# EAGLE design devkit (EAGLE 9.6.2)

## Sheet 1 of 2
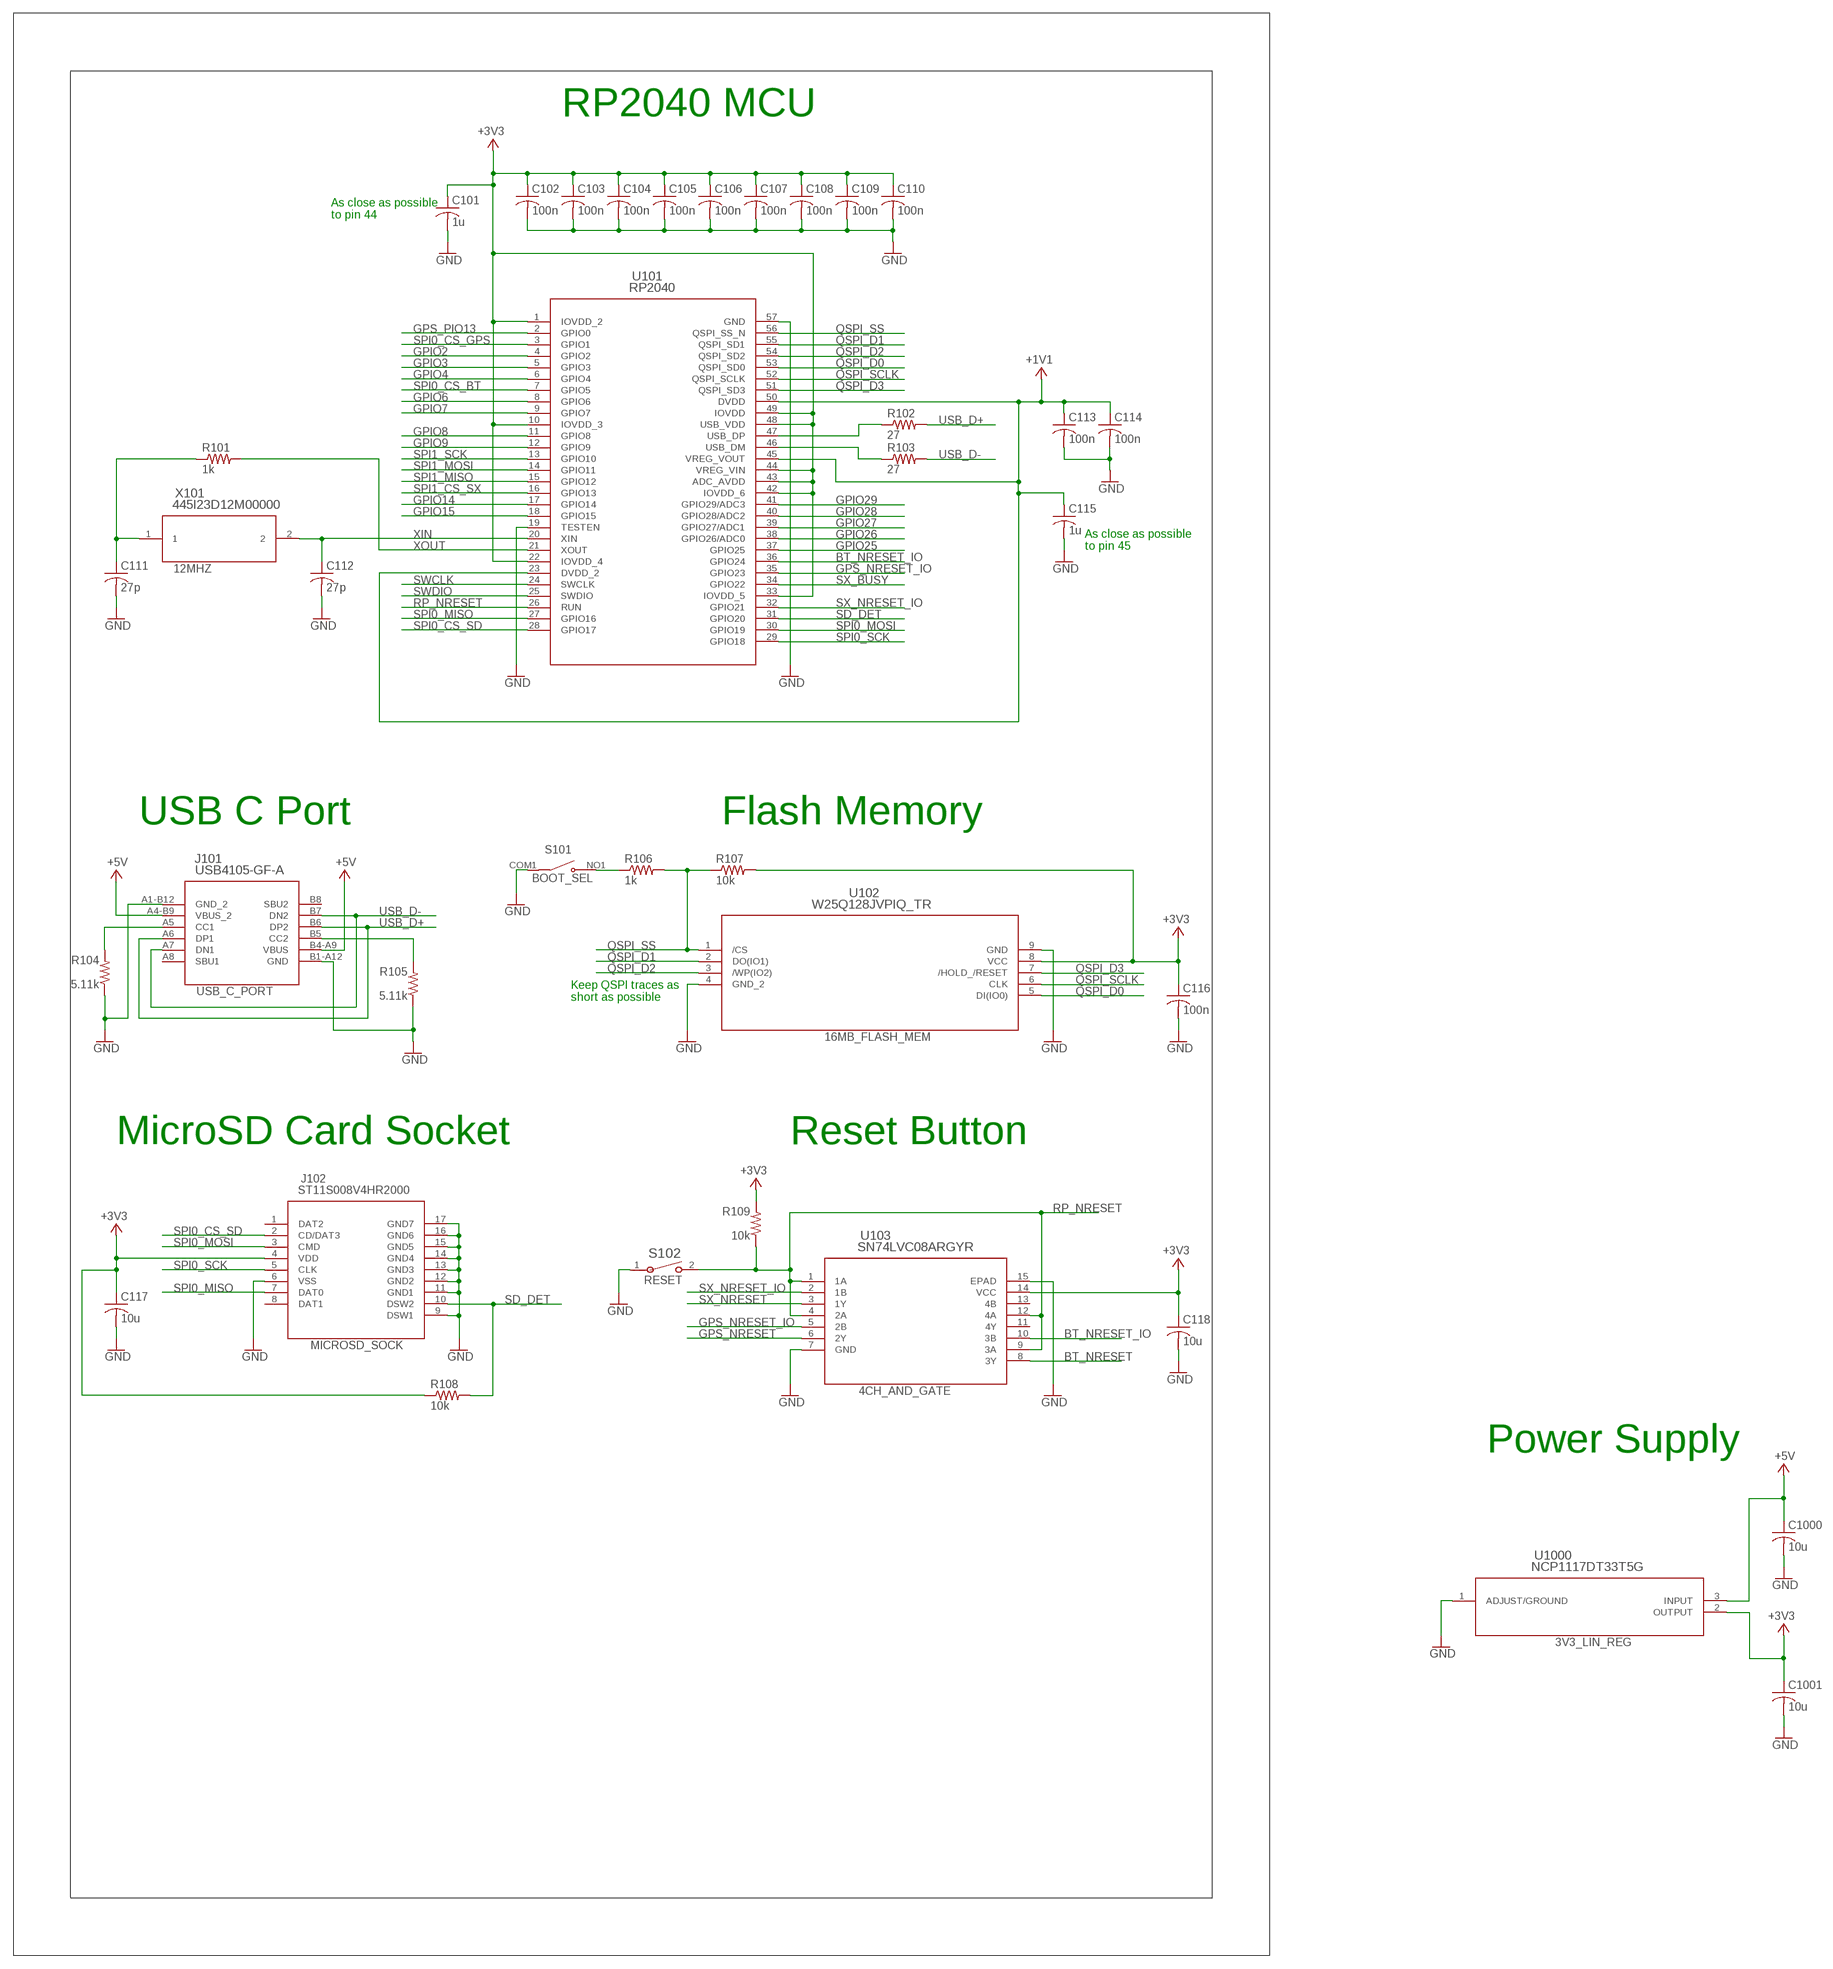
[diagram p0: schematic, sheet 1]

### Parts
C101  1u  C-USC0402  [C0402]
C102  100n  C-USC0402  [C0402]
C103  100n  C-USC0402  [C0402]
C104  100n  C-USC0402  [C0402]
C105  100n  C-USC0402  [C0402]
C106  100n  C-USC0402  [C0402]
C107  100n  C-USC0402  [C0402]
C108  100n  C-USC0402  [C0402]
C109  100n  C-USC0402  [C0402]
C110  100n  C-USC0402  [C0402]
C111  27p  C-USC0402  [C0402]
C112  27p  C-USC0402  [C0402]
C113  100n  C-USC0402  [C0402]
C114  100n  C-USC0402  [C0402]
C115  1u  C-USC0402  [C0402]
C116  100n  C-USC0402  [C0402]
C117  10u  C-USC0402  [C0402]
C118  10u  C-USC0402  [C0402]
C1000  10u  C-USC0402  [C0402]
C1001  10u  C-USC0402  [C0402]
J101  USB4105-GF-A  [USB4105_GCT]
J102  ST11S008V4HR2000  [ST11S008V4HR2000_JAE]
R101  1k  R-US_R0402  [R0402]
R102  27  R-US_R0402  [R0402]
R103  27  R-US_R0402  [R0402]
R104  5.11k  R-US_R0402  [R0402]
R105  5.11k  R-US_R0402  [R0402]
R106  1k  R-US_R0402  [R0402]
R107  10k  R-US_R0402  [R0402]
R108  10k  R-US_R0402  [R0402]
R109  10k  R-US_R0402  [R0402]
S101  SDA01H1SBD  [SW_SDA01H1SBD]
S102  PTS820J25MSMTRLFS  [SW2_PTS820J25MSMTRLFS_CNK]
U101  RP2040  SC0908(13)  [IC57_RP2040]
U102  W25Q128JVPIQ_TR  [WSON-8_6X5_WIN]
U103  SN74LVC08ARGYR  [RGY14_2P05X2P05]
U1000  NCP1117DT33T5G  [DPAK-3_ONS]
X101  445I23D12M00000  [445I23D12M00000_CTS]

### Nets
+3V3: C101.1 C102.1 C103.1 C104.1 C105.1 C106.1 C107.1 C108.1 C109.1 C110.1 C116.1 C117.1 C118.1 C1001.1 J102.4(VDD) R107.2 R108.1 R109.2 U101.1(IOVDD_2) U101.10(IOVDD_3) U101.22(IOVDD_4) U101.33(IOVDD_5) U101.42(IOVDD_6) U101.43(ADC_AVDD) U101.44(VREG_VIN) U101.48(USB_VDD) U101.49(IOVDD) U102.8(VCC) U103.14(VCC) U1000.2(OUTPUT) ; also sheet 2
+5V: C1000.1 J101.A4-B9(VBUS_2) J101.B4-A9(VBUS) U1000.3(INPUT)
BT_NRESET: U103.8(3Y)
BT_NRESET_IO: U101.36(GPIO24) U103.10(3B)
GND: C101.2 C102.2 C103.2 C104.2 C105.2 C106.2 C107.2 C108.2 C109.2 C110.2 C111.2 C112.2 C113.2 C114.2 C115.2 C116.2 C117.2 C118.2 C1000.2 C1001.2 J101.A1-B12(GND_2) J101.B1-A12(GND) J102.6(VSS) J102.9(DSW1) J102.11(GND1) J102.12(GND2) J102.13(GND3) J102.14(GND4) J102.15(GND5) J102.16(GND6) J102.17(GND7) R104.1 R105.1 S101.COM1(COM) S102.1 U101.19(TESTEN) U101.57(GND) U102.4(GND_2) U102.9(GND) U103.7(GND) U103.15(EPAD) U1000.1(ADJUST/GROUND) ; also sheet 2
GPIO2: U101.4(GPIO2)
GPIO3: U101.5(GPIO3)
GPIO4: U101.6(GPIO4)
GPIO6: U101.8(GPIO6)
GPIO7: U101.9(GPIO7)
GPIO8: U101.11(GPIO8)
GPIO9: U101.12(GPIO9)
GPIO14: U101.17(GPIO14)
GPIO15: U101.18(GPIO15)
GPIO25: U101.37(GPIO25)
GPIO26: U101.38(GPIO26/ADC0)
GPIO27: U101.39(GPIO27/ADC1)
GPIO28: U101.40(GPIO28/ADC2)
GPIO29: U101.41(GPIO29/ADC3)
GPS_NRESET: U103.6(2Y) ; also sheet 2
GPS_NRESET_IO: U101.35(GPIO23) U103.5(2B)
GPS_PIO13: U101.2(GPIO0) ; also sheet 2
N$1: R106.1 S101.NO1(NO)
N$2: R102.1 U101.47(USB_DP)
N$3: R103.1 U101.46(USB_DM)
N$7: C111.1 R101.1 X101.1
N$17: J101.B5(CC2) R105.2
N$20: J101.A5(CC1) R104.2
QSPI_D0: U101.53(QSPI_SD0) U102.5(DI(IO0))
QSPI_D1: U101.55(QSPI_SD1) U102.2(DO(IO1))
QSPI_D2: U101.54(QSPI_SD2) U102.3(/WP(IO2))
QSPI_D3: U101.51(QSPI_SD3) U102.7(/HOLD_/RESET)
QSPI_SCLK: U101.52(QSPI_SCLK) U102.6(CLK)
QSPI_SS: R106.2 R107.1 U101.56(QSPI_SS_N) U102.1(/CS)
RP_NRESET: R109.1 S102.2 U101.26(RUN) U103.1(1A) U103.4(2A) U103.9(3A) U103.12(4A)
SD_DET: J102.10(DSW2) R108.2 U101.31(GPIO20)
SPI0_CS_BT: U101.7(GPIO5)
SPI0_CS_GPS: U101.3(GPIO1) ; also sheet 2
SPI0_CS_SD: J102.2(CD/DAT3) U101.28(GPIO17)
SPI0_MISO: J102.7(DAT0) U101.27(GPIO16) ; also sheet 2
SPI0_MOSI: J102.3(CMD) U101.30(GPIO19) ; also sheet 2
SPI0_SCK: J102.5(CLK) U101.29(GPIO18) ; also sheet 2
SPI1_CS_SX: U101.16(GPIO13) ; also sheet 2
SPI1_MISO: U101.15(GPIO12) ; also sheet 2
SPI1_MOSI: U101.14(GPIO11) ; also sheet 2
SPI1_SCK: U101.13(GPIO10) ; also sheet 2
SWCLK: U101.24(SWCLK)
SWDIO: U101.25(SWDIO)
SX_BUSY: U101.34(GPIO22) ; also sheet 2
SX_NRESET: U103.3(1Y) ; also sheet 2
SX_NRESET_IO: U101.32(GPIO21) U103.2(1B)
USB_D+: J101.A6(DP1) J101.B6(DP2) R102.2
USB_D-: J101.A7(DN1) J101.B7(DN2) R103.2
VCC: C113.1 C114.1 C115.1 U101.23(DVDD_2) U101.45(VREG_VOUT) U101.50(DVDD) ; supply symbol labelled +1V1
XIN: C112.1 U101.20(XIN) X101.2
XOUT: R101.2 U101.21(XOUT)
Unconnected: J101.A8(SBU1) J101.B8(SBU2) J102.1(DAT2) J102.8(DAT1) U103.11(4Y) U103.13(4B)

### Notes on the sheet
- RP2040 MCU
- As close as possible
  to pin 44
- As close as possible
  to pin 45
- USB C Port | Flash Memory
- Keep QSPI traces as
  short as possible
- MicroSD Card Socket | Reset Button
- Power Supply

## Sheet 2 of 2
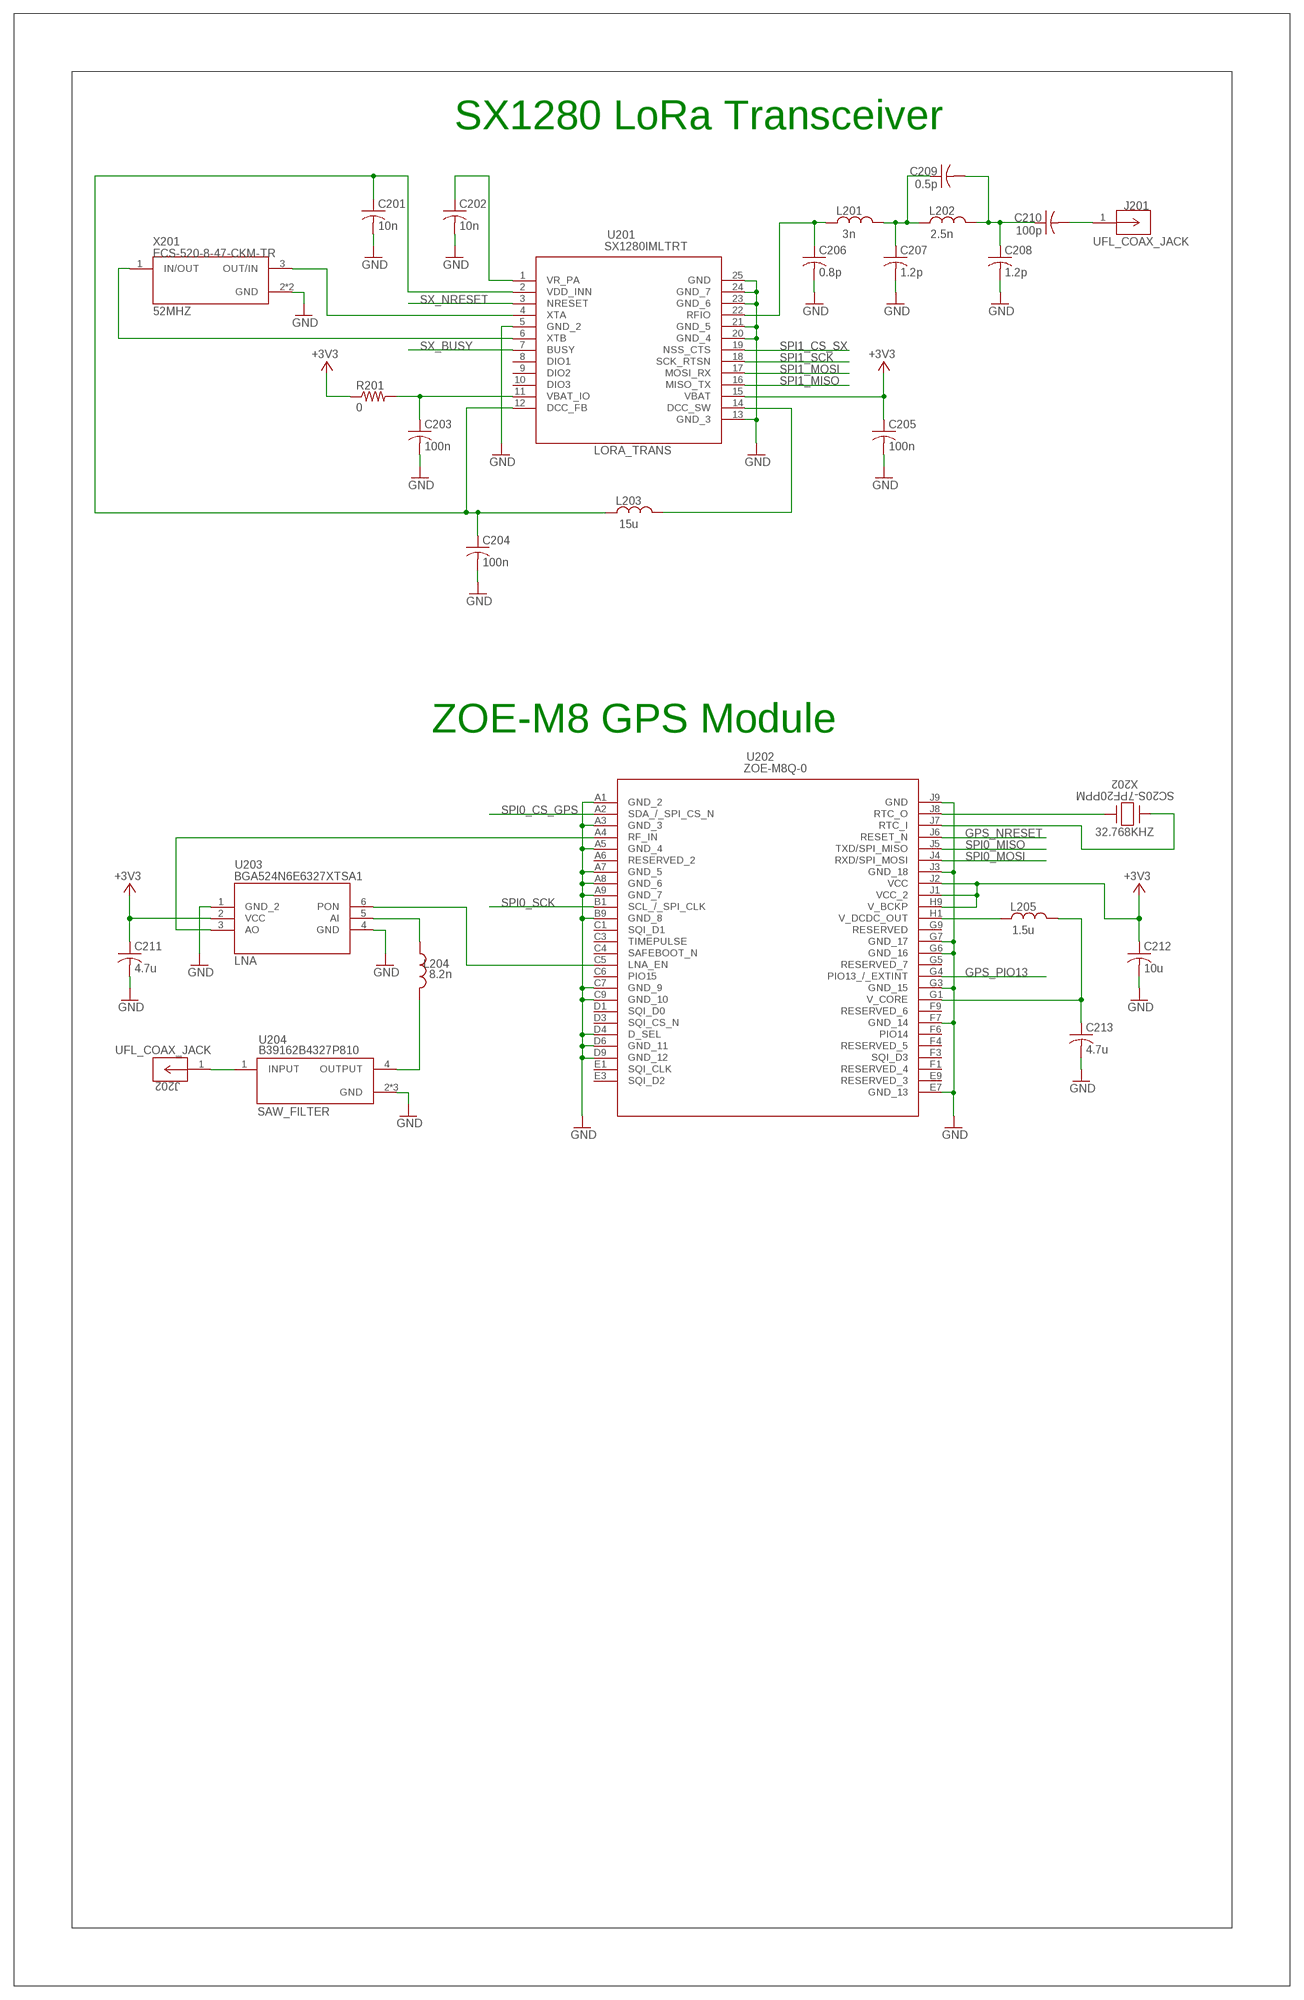
[diagram p1: schematic, sheet 2]

### Parts
C201  10n  C-USC0402  [C0402]
C202  10n  C-USC0402  [C0402]
C203  100n  C-USC0402  [C0402]
C204  100n  C-USC0402  [C0402]
C205  100n  C-USC0402  [C0402]
C206  0.8p  C-USC0402  [C0402]
C207  1.2p  C-USC0402  [C0402]
C208  1.2p  C-USC0402  [C0402]
C209  0.5p  C-USC0402  [C0402]
C210  100p  C-USC0402  [C0402]
C211  4.7u  C-USC0402  [C0402]
C212  10u  C-USC0402  [C0402]
C213  4.7u  C-USC0402  [C0402]
J201  CONUFL001-SMD-T  [CONN_CONUFL001-SMD-T_LNX]
J202  CONUFL001-SMD-T  [CONN_CONUFL001-SMD-T_LNX]
L201  3n  L_CHIP-0402(1006-METRIC)  [INDC1006X60N]
L202  2.5n  L_CHIP-0402(1006-METRIC)  [INDC1006X60N]
L203  15u  L_CHIP-0805(2012-METRIC)  [INDC2009X120]
L204  8.2n  L_CHIP-0402(1006-METRIC)  [INDC1006X60N]
L205  1.5u  L_CHIP-0805(2012-METRIC)  [INDC2009X120]
R201  0  R-US_R0402  [R0402]
U201  SX1280IMLTRT  [QFN24_4X4_SEM]
U202  ZOE-M8Q-0  [BGA_E-M8Q-0_UBL]
U203  BGA524N6E6327XTSA1  [PG-TSNP-6-2_INF]
U204  B39162B4327P810  [FIL_B39162B4327P810]
X201  ECS-520-8-47-CKM-TR  [XTAL_ECS-520-8-47-CKM-TR]
X202  SC20S-7PF20PPM  [XTAL_SC-20S_EPS]

### Nets
+3V3: C205.1 C211.1 C212.1 R201.1 U201.15(VBAT) U202.H9(V_BCKP) U202.J1(VCC_2) U202.J2(VCC) U203.2(VCC) ; also sheet 1
GND: C201.2 C202.2 C203.2 C204.2 C205.2 C206.2 C207.2 C208.2 C211.2 C212.2 C213.2 U201.5(GND_2) U201.13(GND_3) U201.20(GND_4) U201.21(GND_5) U201.23(GND_6) U201.24(GND_7) U201.25(GND) U202.A1(GND_2) U202.A3(GND_3) U202.A5(GND_4) U202.A7(GND_5) U202.A8(GND_6) U202.A9(GND_7) U202.B9(GND_8) U202.C7(GND_9) U202.C9(GND_10) U202.D4(D_SEL) U202.D6(GND_11) U202.D9(GND_12) U202.E7(GND_13) U202.F7(GND_14) U202.G3(GND_15) U202.G6(GND_16) U202.G7(GND_17) U202.J3(GND_18) U202.J9(GND) U203.1(GND_2) U203.4(GND) U204.2(GND) U204.3(GND) U204.5(GND) X201.2(GND) X201.4(GND) ; also sheet 1
GPS_NRESET: U202.J6(RESET_N) ; also sheet 1
GPS_PIO13: U202.G4(PIO13_/_EXTINT) ; also sheet 1
N$4: C203.1 R201.2 U201.11(VBAT_IO)
N$5: L203.2 U201.14(DCC_SW)
N$6: C210.2 J201.1
N$8: C201.1 C204.1 L203.1 U201.2(VDD_INN) U201.12(DCC_FB)
N$9: C202.1 U201.1(VR_PA)
N$10: U201.6(XTB) X201.1(IN/OUT)
N$11: U201.4(XTA) X201.3(OUT/IN)
N$12: C208.1 C209.2 C210.1 L202.2
N$13: C207.1 C209.1 L201.2 L202.1
N$14: J202.1 U204.1(INPUT)
N$15: C206.1 L201.1 U201.22(RFIO)
N$16: L204.1 U203.5(AI)
N$19: L204.2 U204.4(OUTPUT)
N$21: U202.J8(RTC_O) X202.2
N$22: U202.J7(RTC_I) X202.1
N$23: L205.1 U202.H1(V_DCDC_OUT)
N$24: U202.A4(RF_IN) U203.3(AO)
N$25: U202.C5(LNA_EN) U203.6(PON)
SPI0_CS_GPS: U202.A2(SDA_/_SPI_CS_N) ; also sheet 1
SPI0_MISO: U202.J5(TXD/SPI_MISO) ; also sheet 1
SPI0_MOSI: U202.J4(RXD/SPI_MOSI) ; also sheet 1
SPI0_SCK: U202.B1(SCL_/_SPI_CLK) ; also sheet 1
SPI1_CS_SX: U201.19(NSS_CTS) ; also sheet 1
SPI1_MISO: U201.16(MISO_TX) ; also sheet 1
SPI1_MOSI: U201.17(MOSI_RX) ; also sheet 1
SPI1_SCK: U201.18(SCK_RTSN) ; also sheet 1
SX_BUSY: U201.7(BUSY) ; also sheet 1
SX_NRESET: U201.3(NRESET) ; also sheet 1
U1: C213.1 L205.2 U202.G1(V_CORE)
Unconnected: U201.8(DIO1) U201.9(DIO2) U201.10(DIO3) U202.A6(RESERVED_2) U202.C1(SQI_D1) U202.C3(TIMEPULSE) U202.C4(SAFEBOOT_N) U202.C6(PIO15) U202.D1(SQI_D0) U202.D3(SQI_CS_N) U202.E1(SQI_CLK) U202.E3(SQI_D2) U202.E9(RESERVED_3) U202.F1(RESERVED_4) U202.F3(SQI_D3) U202.F4(RESERVED_5) U202.F6(PIO14) U202.F9(RESERVED_6) U202.G5(RESERVED_7) U202.G9(RESERVED)

### Notes on the sheet
- SX1280 LoRa Transceiver
- ZOE-M8 GPS Module

## Library data of the parts
C101-C118 C201-C213 C1000 C1001 = resistor:C-US: CAPACITOR, American symbol
J101 = USB4105-GF-A_USB_C:USB4105-GF-A; COPYRIGHT: Copyright (C) 2022 Ultra Librarian. All rights reserved.; DESCRIPTION: USB_C_PORT; DIGI-KEY_PART_NUMBER_1: 2073-USB4105-GF-ACT-ND; DIGI-KEY_PART_NUMBER_2: 2073-USB4105-GF-ADKR-ND; DIGI-KEY_PART_NUMBER_3: 2073-USB4105-GF-ATR-ND; MANUFACTURER_PART_NUMBER: USB4105-GF-A; MFR_NAME: Global Connector Technology
J102 = MicroSD_Socket:ST11S008V4HR2000; COPYRIGHT: Copyright (C) 2022 Ultra Librarian. All rights reserved.; DESCRIPTION: MICROSD_SOCK; DIGI-KEY_PART_NUMBER_1: 670-2695-2-ND; DIGI-KEY_PART_NUMBER_2: 670-2695-1-ND; DIGI-KEY_PART_NUMBER_3: 670-2695-6-ND; MANUFACTURER_PART_NUMBER: ST11S008V4HR2000; MFR_NAME: JAE Electronics
J201 J202 = UFL_CoaxJack:CONUFL001-SMD-T; COPYRIGHT: Copyright (C) 2022 Ultra Librarian. All rights reserved.; DESCRIPTION: UFL_COAX_JACK; DIGI-KEY_PART_NUMBER_1: CONUFL001-SMD-TTR-ND; DIGI-KEY_PART_NUMBER_2: CONUFL001-SMD-TCT-ND; DIGI-KEY_PART_NUMBER_3: CONUFL001-SMD-TDKR-ND; MANUFACTURER_PART_NUMBER: CONUFL001-SMD-T; MFR_NAME: Linx Technologies
L201-L205 = Inductor:L: Inductor Fixed - Generic; CATEGORY: Inductor; SUB-CATEGORY: Fixed
R101-R109 R201 = resistor:R-US_: RESISTOR, American symbol
S101 = SDA01H1SBD_SPST_DIP:SDA01H1SBD: Dip Switch SPST 1 Position Surface Mount Slide (Standard) Actuator 25mA 24VDC; DESCRIPTION: BOOT_SEL; DIGI-KEY_PART_NUMBER: CKN10358-ND; MF: C&K; MP: SDA01H1SBD; PACKAGE: None; PURCHASE-URL: https://pricing.snapeda.com/search/part/SDA01H1SBD/?ref=eda
S102 = PTS820J25MSMTRLFS_SPST_Btn:PTS820J25MSMTRLFS; COPYRIGHT: Copyright (C) 2022 Ultra Librarian. All rights reserved.; DESCRIPTION: RESET; DIGI-KEY_PART_NUMBER_1: PTS820 J25M SMTR LFS-ND; DIGI-KEY_PART_NUMBER_2: CKN10839TR-ND; DIGI-KEY_PART_NUMBER_3: CKN10839CT-ND; DIGI-KEY_PART_NUMBER_4: CKN10839DKR-ND; MANUFACTURER_PART_NUMBER: PTS820J25MSMTRLFS; MFR_NAME: C&K
U101 = RP2040:SC0908(13); COPYRIGHT: Copyright (C) 2022 Ultra Librarian. All rights reserved.; DIGI-KEY_PART_NUMBER_1: 2648-SC0908(13)TR-ND; DIGI-KEY_PART_NUMBER_2: 2648-SC0908(13)CT-ND; DIGI-KEY_PART_NUMBER_3: 2648-SC0908(13)DKR-ND; MANUFACTURER_PART_NUMBER: SC0908(13); MFR_NAME: Raspberry Pi
U102 = W25Q128JVP_16MB_Flash:W25Q128JVPIQ_TR; COPYRIGHT: Copyright (C) 2022 Ultra Librarian. All rights reserved.; DESCRIPTION: 16MB_FLASH_MEM; DIGI-KEY_PART_NUMBER_1: W25Q128JVPIQ CT-ND; DIGI-KEY_PART_NUMBER_2: W25Q128JVPIQ DKR-ND; DIGI-KEY_PART_NUMBER_3: W25Q128JVPIQ TR-ND; DIGI-KEY_PART_NUMBER_4: W25Q128JVPIQCT-ND; DIGI-KEY_PART_NUMBER_5: W25Q128JVPIQDKR-ND; DIGI-KEY_PART_NUMBER_6: W25Q128JVPIQTR-ND; MANUFACTURER_PART_NUMBER: W25Q128JVPIQ TR; MFR_NAME: Winbond
U103 = SN74LVC08ARGYR_Quad_And_Gate:SN74LVC08ARGYR; COPYRIGHT: Copyright (C) 2022 Ultra Librarian. All rights reserved.; DESCRIPTION: 4CH_AND_GATE; DIGI-KEY_PART_NUMBER_1: 296-13959-1-ND; DIGI-KEY_PART_NUMBER_2: 296-13959-2-ND; DIGI-KEY_PART_NUMBER_3: 296-13959-6-ND; DIGI-KEY_PART_NUMBER_4: 2156-SN74LVC08ARGYR-ND; MANUFACTURER_PART_NUMBER: SN74LVC08ARGYR; MFR_NAME: Texas Instruments
U201 = SX1280:SX1280IMLTRT; COPYRIGHT: Copyright (C) 2022 Ultra Librarian. All rights reserved.; DESCRIPTION: LORA_TRANS; DIGI-KEY_PART_NUMBER_1: SX1280IMLTRTTR-ND; DIGI-KEY_PART_NUMBER_2: SX1280IMLTRTCT-ND; DIGI-KEY_PART_NUMBER_3: SX1280IMLTRTDKR-ND; MANUFACTURER_PART_NUMBER: SX1280IMLTRT; MFR_NAME: Semtech
U202 = ZOE-M8Q_GPS_Module:ZOE-M8Q-0; COPYRIGHT: Copyright (C) 2022 Ultra Librarian. All rights reserved.; DIGI-KEY_PART_NUMBER_1: 672-ZOE-M8Q-0TR-ND; DIGI-KEY_PART_NUMBER_2: 672-ZOE-M8Q-0CT-ND; DIGI-KEY_PART_NUMBER_3: 672-ZOE-M8Q-0DKR-ND; MANUFACTURER_PART_NUMBER: ZOE-M8Q-0; MFR_NAME: Ublox
U203 = BGA524N6E6327XTSA1_LNA:BGA524N6E6327XTSA1; COPYRIGHT: Copyright (C) 2022 Ultra Librarian. All rights reserved.; DESCRIPTION: LNA; DIGI-KEY_PART_NUMBER_1: BGA524N6E6327XTSA1TR-ND; DIGI-KEY_PART_NUMBER_2: BGA524N6E6327XTSA1CT-ND; DIGI-KEY_PART_NUMBER_3: BGA524N6E6327XTSA1DKR-ND; DIGI-KEY_PART_NUMBER_4: 2156-BGA524N6E6327XTSA1-ND; MANUFACTURER_PART_NUMBER: BGA524N6E6327XTSA1; MFR_NAME: Infineon
U204 = B39162B4327P810_SAW_Filter:B39162B4327P810: Frequency RF SAW Filter (Sound Acoustic Wave) Bandwidth 5-SMD, No Lead; DECRIPTION: SAW_FILTER; DESCRIPTION: Frequency RF SAW Filter (Surface Acoustic Wave) Bandwidth 5-SMD, No Lead; DIGI-KEY_PART_NUMBER: 495-7424-2-ND; MF: Qualcomm (RF360; MP: B39162B4327P810; PACKAGE: SMD-5 Qualcomm (RF360; PURCHASE-URL: https://pricing.snapeda.com/search/part/B39162B4327P810/?ref=eda
U1000 = NCP1117_LinReg_3V3:NCP1117DT33T5G; COPYRIGHT: Copyright (C) 2022 Ultra Librarian. All rights reserved.; DESCRIPTION: 3V3_LIN_REG; DIGI-KEY_PART_NUMBER_1: 2156-NCP1117DT33T5G-OS-ND; DIGI-KEY_PART_NUMBER_2: =NCP1117DT33T5G; DIGI-KEY_PART_NUMBER_3: NCP1117DT33T5GOSCT-ND; DIGI-KEY_PART_NUMBER_4: NCP1117DT33T5GOSDKR-ND; DIGI-KEY_PART_NUMBER_5: NCP1117DT33T5GOSTR-ND; MANUFACTURER_PART_NUMBER: NCP1117DT33T5G; MFR_NAME: onsemi
X101 = 445I23D12M_12MHz_Crystal:445I23D12M00000; COPYRIGHT: Copyright (C) 2022 Ultra Librarian. All rights reserved.; DESCRIPTION: 12MHZ; DIGI-KEY_PART_NUMBER_1: CTX1170TR-ND; DIGI-KEY_PART_NUMBER_2: CTX1170CT-ND; DIGI-KEY_PART_NUMBER_3: CTX1170DKR-ND; MANUFACTURER_PART_NUMBER: 445I23D12M00000; MFR_NAME: CTS Components
X201 = ECS-520-8-47-CKM-TR_52MHz_Crystal:ECS-520-8-47-CKM-TR: Crystal 4-SMD, No Lead; DESCRIPTION: 52MHZ; DIGI-KEY_PART_NUMBER: XC2554TR-ND; MF: ECS Inc.; MP: ECS-520-8-47-CKM-TR; PACKAGE: SMD-4 ECS International; PURCHASE-URL: https://pricing.snapeda.com/search/part/ECS-520-8-47-CKM-TR/?ref=eda
X202 = SC20S-7PF20PPM_32.768KHz_Crystal:SC20S-7PF20PPM; COPYRIGHT: Copyright (C) 2022 Ultra Librarian. All rights reserved.; DESCRIPTION: 32.768KHZ; DIGI-KEY_PART_NUMBER_1: 728-1076-2-ND; DIGI-KEY_PART_NUMBER_2: 728-1076-1-ND; DIGI-KEY_PART_NUMBER_3: 728-1076-6-ND; MANUFACTURER_PART_NUMBER: SC20S-7PF20PPM; MFR_NAME: Epson

## Board
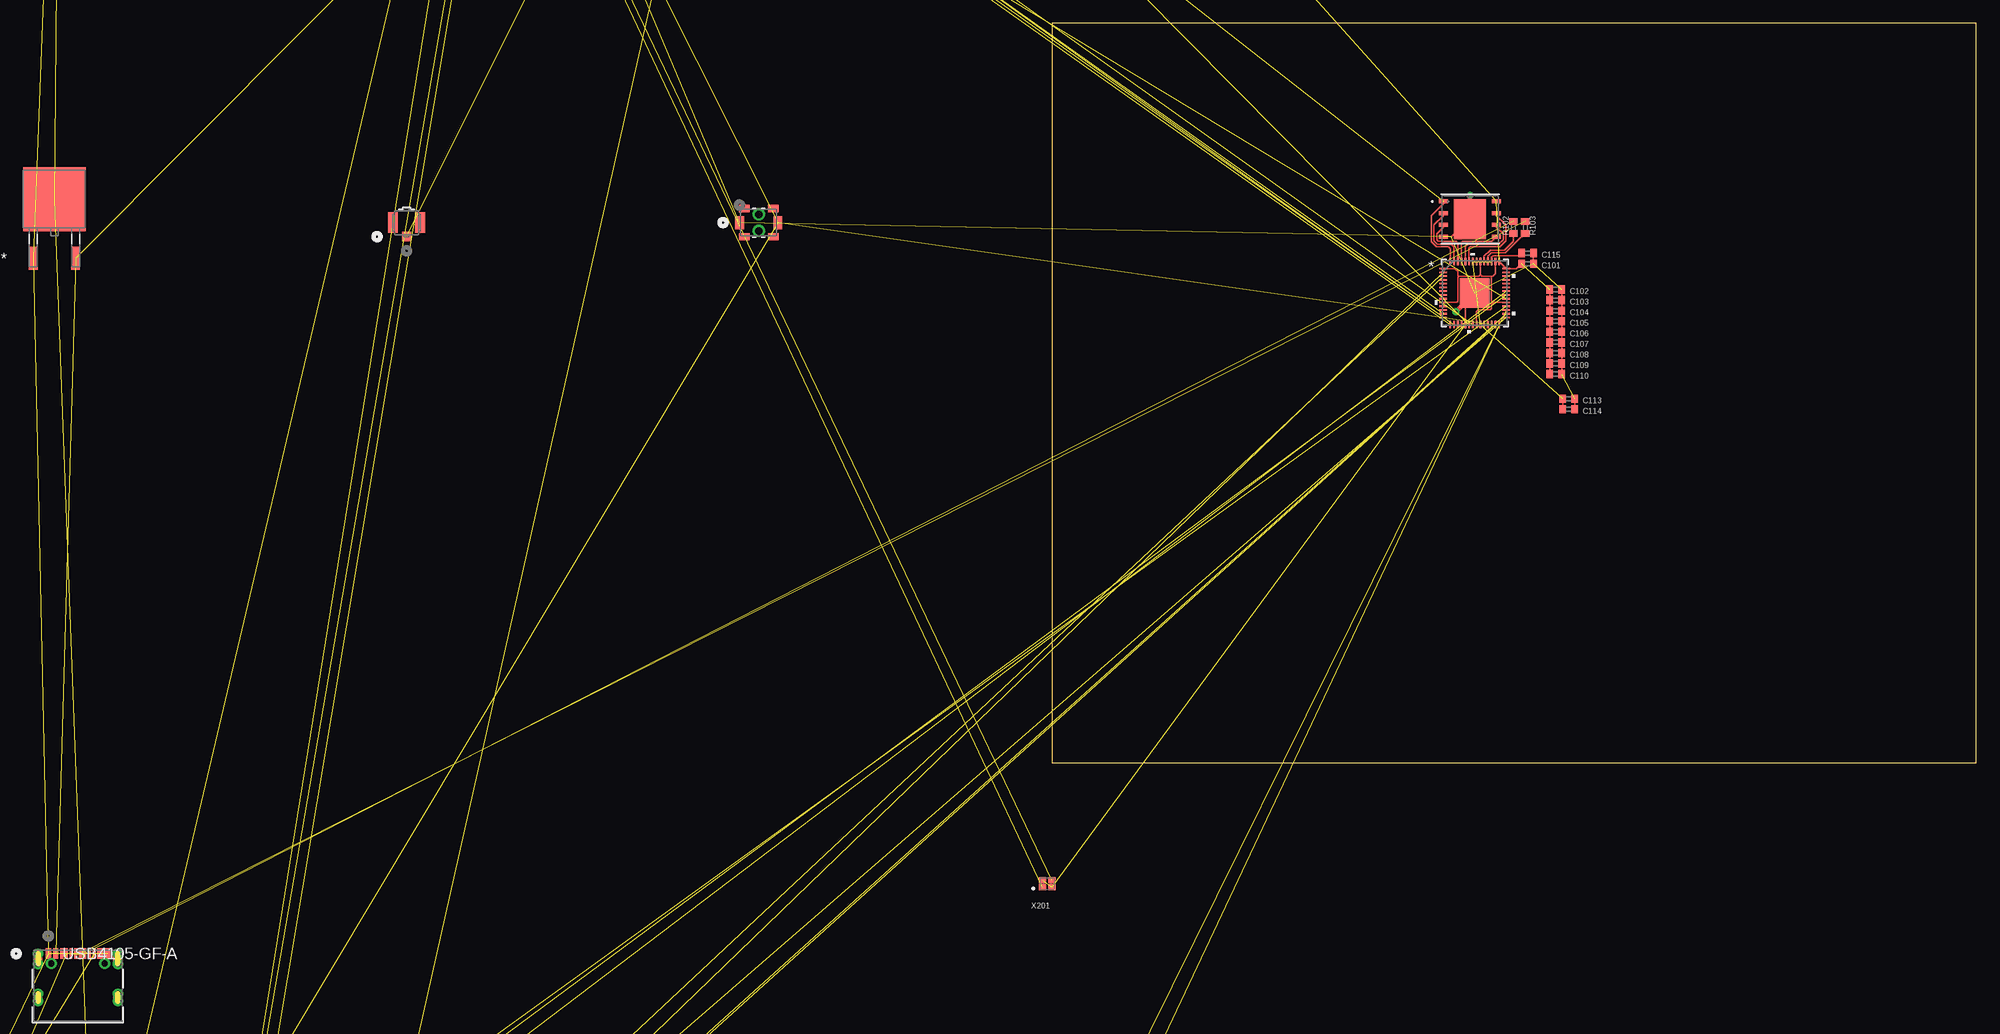
[diagram p2: board, top side]
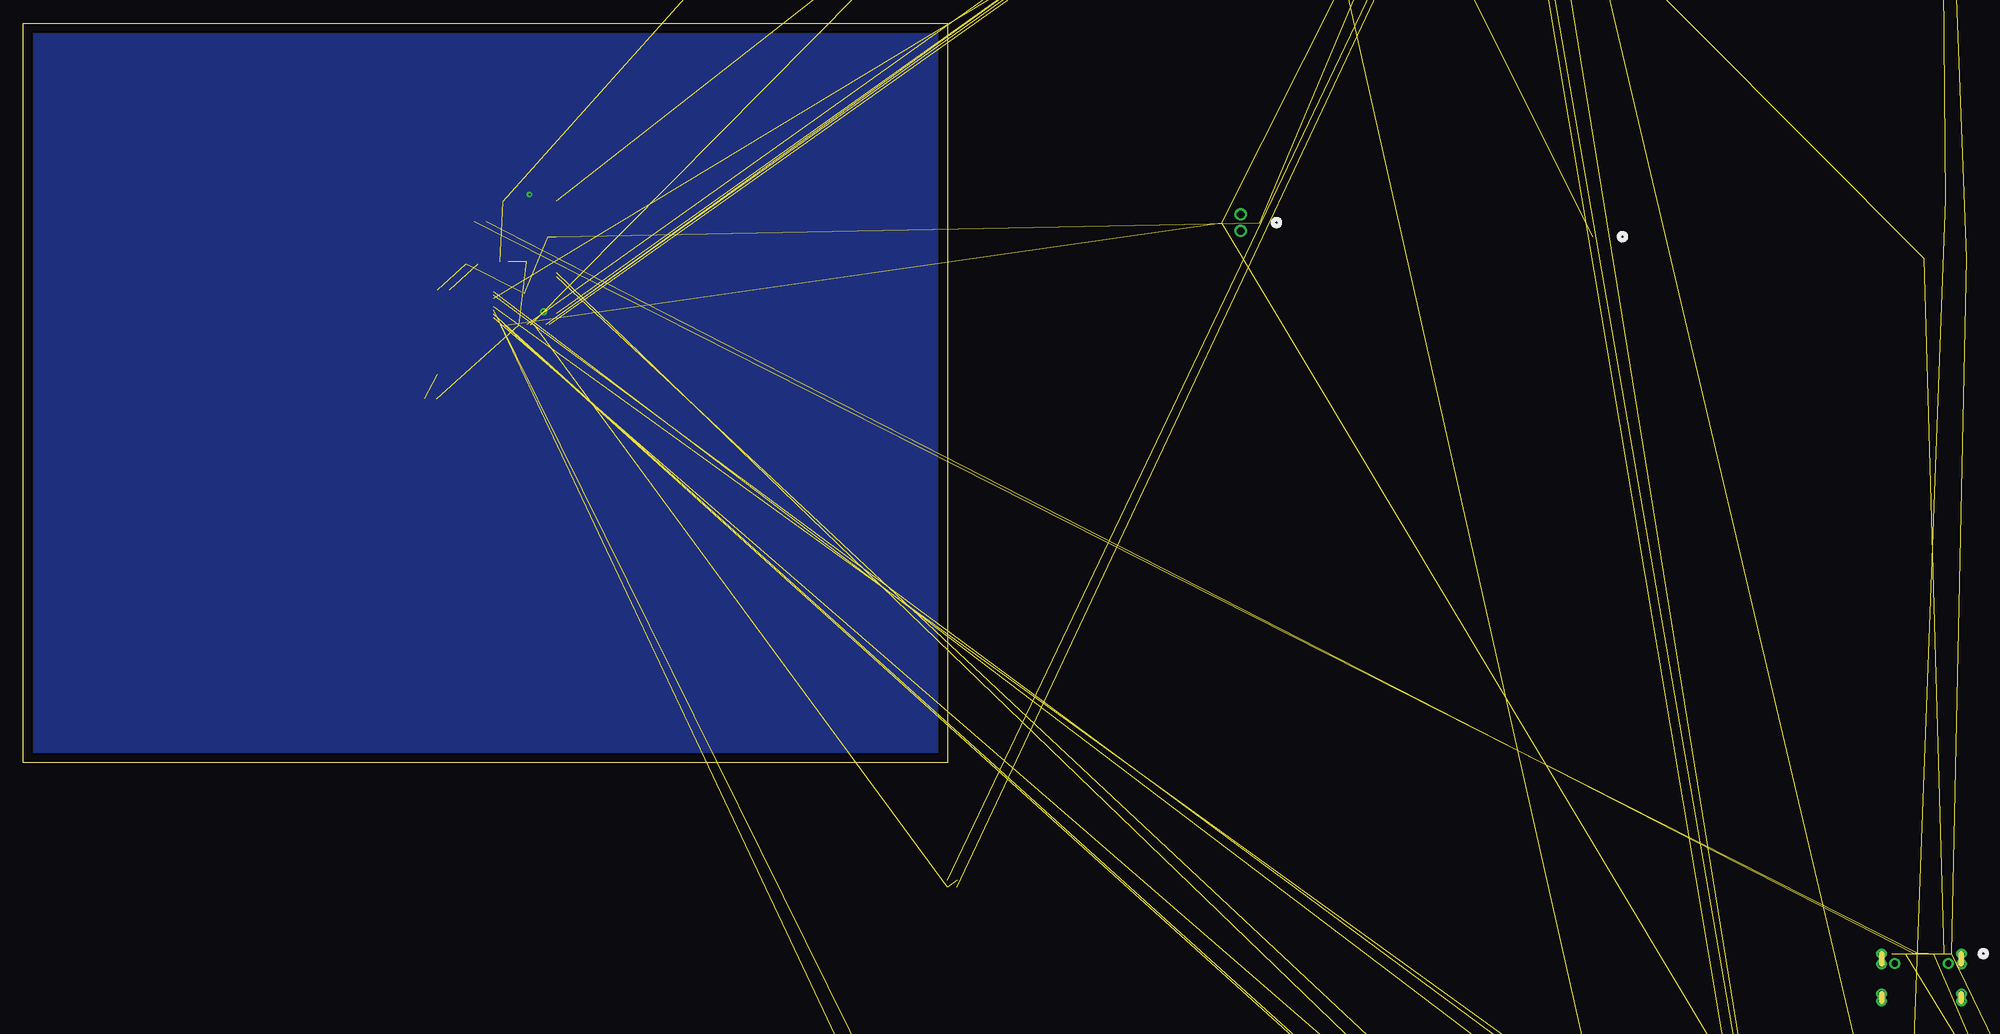
[diagram p3: board, bottom side, seen from below]

Size 100 x 80 mm. Coordinates in mm from the lower left corner, seen from the top.
Outline: 0,0 100,0 100,80 0,80 0,0
Copper layers (1*16): Top 0.035mm / dielectric 0.15mm / Bottom 0.035mm
Design rules "default": minimum track width 6mil, minimum drill 0.35mm, track to track 6mil, track to pad 6mil, pad to pad 6mil, via to via 6mil, smd to smd 6mil, copper to edge 40mil, drill to drill 6mil, minimum pad ring 10mil, minimum via ring 8mil, stop-mask expansion 4mil, vias tented up to drill 0mil, thermal gap 10mil

### Footprints (pad centres in the part's own frame; a part is rotated, then mirrored left to right if it is on the bottom)
C0402 = smd 0.7 x 0.9: 1 -0.65,0; 2 0.65,0
USB4105_GCT = smd 0.991 x 1.803: 13 -4.32,-1.269; 14 4.32,-1.269 | smd 0.991 x 2.108: 15 -4.32,2.911; 16 4.32,2.911 | drill 0.66 pad 0.66: 17 -2.896,2.413; 18 2.896,2.413 | smd 0.584 x 1.143: A1-B12 -3.2,3.486; A4-B9 -2.4,3.486; B1-A12 3.2,3.486; B4-A9 2.4,3.486 | smd 0.305 x 1.143: A5 -1.25,3.486; A6 -0.25,3.486; A7 0.25,3.486; A8 1.25,3.486; B5 1.75,3.486; B6 0.75,3.486; B7 -0.75,3.486; B8 -1.75,3.486 | drill 0.61 pad 0.61: S_1_H1 -4.318,-0.864; S_1_H2 -4.318,-1.651; S_2_H1 4.318,-0.864; S_2_H2 4.318,-1.651; S_3_H1 -4.318,3.454; S_3_H2 -4.318,2.362; S_4_H1 4.318,3.454; S_4_H2 4.318,2.362
ST11S008V4HR2000_JAE = smd 0.635 x 0.711: 1 2.37,0.295; 2 1.27,0.295; 3 0.17,0.295; 4 -0.93,0.295; 5 -2.03,0.295; 6 -3.13,0.295; 7 -4.23,0.295; 8 -5.33,0.295 | smd 1.549 x 0.559: 9 -5.225,7.07 | smd 0.711 x 0.711: 10 -3.33,6.495 | smd 0.559 x 1.448: 11 6.685,-6.93 | smd 0.508 x 1.651: 12 6.71,0.02 | smd 0.559 x 1.956: 13 6.685,6.665 | smd 0.559 x 1.854: 14 -6.685,6.72 | smd 0.508 x 0.813: 15 -6.71,3.435 | smd 0.508 x 1.143: 16 -6.71,1.22 | smd 1.016 x 1.473: 17 -6.465,-6.805
CONN_CONUFL001-SMD-T_LNX = smd 0.991 x 1.041: 1 0,-1.511 | smd 1.041 x 2.21: 2 -1.473,0; 3 1.473,0
INDC1006X60N = smd 0.56 x 0.729: 1 -0.485,0; 2 0.485,0
INDC2009X120 = smd 0.876 x 1.21: 1 -1.067,0; 2 1.067,0
R0402 = smd 0.7 x 0.9: 1 -0.65,0; 2 0.65,0
SW_SDA01H1SBD = smd 2.15 x 1.5: COM1 -4.125,0; NO1 4.125,0
SW2_PTS820J25MSMTRLFS_CNK = smd 0.94 x 1.397: 1 -2.075,0; 2 2.075,0 | smd 1.143 x 0.762: 3 -1.575,1.525; 4 1.575,1.525; 5 -1.575,-1.525; 6 1.575,-1.525 | drill 0.813 pad 0.813: 7 0,0.889; 8 0,-0.889
IC57_RP2040 = smd 0.813 x 0.178: 1 -3.404,2.642; 2 -3.404,2.235; 3 -3.404,1.829; 4 -3.404,1.422; 5 -3.404,1.016; 6 -3.404,0.61; 7 -3.404,0.203; 8 -3.404,-0.203; 9 -3.404,-0.61; 10 -3.404,-1.016; 11 -3.404,-1.422; 12 -3.404,-1.829; 13 -3.404,-2.235; 14 -3.404,-2.642; 29 3.404,-2.642; 30 3.404,-2.235; 31 3.404,-1.829; 32 3.404,-1.422; 33 3.404,-1.016; 34 3.404,-0.61; 35 3.404,-0.203; 36 3.404,0.203; 37 3.404,0.61; 38 3.404,1.016; 39 3.404,1.422; 40 3.404,1.829; 41 3.404,2.235; 42 3.404,2.642 | smd 0.178 x 0.813: 15 -2.642,-3.404; 16 -2.235,-3.404; 17 -1.829,-3.404; 18 -1.422,-3.404; 19 -1.016,-3.404; 20 -0.61,-3.404; 21 -0.203,-3.404; 22 0.203,-3.404; 23 0.61,-3.404; 24 1.016,-3.404; 25 1.422,-3.404; 26 1.829,-3.404; 27 2.235,-3.404; 28 2.642,-3.404; 43 2.642,3.404; 44 2.235,3.404; 45 1.829,3.404; 46 1.422,3.404; 47 1.016,3.404; 48 0.61,3.404; 49 0.203,3.404; 50 -0.203,3.404; 51 -0.61,3.404; 52 -1.016,3.404; 53 -1.422,3.404; 54 -1.829,3.404; 55 -2.235,3.404; 56 -2.642,3.404 | smd 3.2 x 3.2: 57 0,0
WSON-8_6X5_WIN = smd 0.965 x 0.432: 1 -2.87,1.905; 2 -2.87,0.635; 3 -2.87,-0.635; 4 -2.87,-1.905; 5 2.87,-1.905; 6 2.87,-0.635; 7 2.87,0.635; 8 2.87,1.905 | smd 3.454 x 4.343: 9 0,0
RGY14_2P05X2P05 = smd 0.28 x 0.85: 1 -0.75,1.731; 7 -0.75,-1.731; 8 0.75,-1.731; 14 0.75,1.731 | smd 0.85 x 0.28: 2 -1.769,1; 3 -1.769,0.5; 4 -1.769,0; 5 -1.769,-0.5; 6 -1.769,-1; 9 1.769,-1; 10 1.769,-0.5; 11 1.769,0; 12 1.769,0.5; 13 1.769,1 | smd 2.05 x 2.05: 15 0,0 | drill 0.254 pad 0.508: V -0.406,-0.406; V_1 -0.406,0.406; V_2 0.406,-0.406; V_3 0.406,0.406
QFN24_4X4_SEM = smd 0.762 x 0.254: 1 -1.968,1.25; 2 -1.968,0.75; 3 -1.968,0.25; 4 -1.968,-0.25; 5 -1.968,-0.75; 6 -1.968,-1.25; 13 1.968,-1.25; 14 1.968,-0.75; 15 1.968,-0.25; 16 1.968,0.25; 17 1.968,0.75; 18 1.968,1.25 | smd 0.254 x 0.762: 7 -1.25,-1.968; 8 -0.75,-1.968; 9 -0.25,-1.968; 10 0.25,-1.968; 11 0.75,-1.968; 12 1.25,-1.968; 19 1.25,1.968; 20 0.75,1.968; 21 0.25,1.968; 22 -0.25,1.968; 23 -0.75,1.968; 24 -1.25,1.968 | smd 2.642 x 2.642: 25 0,0
BGA_E-M8Q-0_UBL = drill 0.279 pad 0.381: A1 -2.007,2.007; A2 -1.499,2.007; A3 -0.991,2.007; A4 -0.508,2.007; A5 0,2.007; A6 0.508,2.007; A7 0.991,2.007; A8 1.499,2.007; A9 2.007,2.007; B1 -2.007,1.499; B9 2.007,1.499; C1 -2.007,0.991; C3 -0.991,0.991; C4 -0.508,0.991; C5 0,0.991; C6 0.508,0.991; C7 0.991,0.991; C9 2.007,0.991; D1 -2.007,0.508; D3 -0.991,0.508; D4 -0.508,0.508; D6 0.508,0.508; D9 2.007,0.508; E1 -2.007,0; E3 -0.991,0; E7 0.991,0; E9 2.007,0; F1 -2.007,-0.508; F3 -0.991,-0.508; F4 -0.508,-0.508; F6 0.508,-0.508; F7 0.991,-0.508; F9 2.007,-0.508; G1 -2.007,-0.991; G3 -0.991,-0.991; G4 -0.508,-0.991; G5 0,-0.991; G6 0.508,-0.991; G7 0.991,-0.991; G9 2.007,-0.991; H1 -2.007,-1.499; H9 2.007,-1.499; J1 -2.007,-2.007; J2 -1.499,-2.007; J3 -0.991,-2.007; J4 -0.508,-2.007; J5 0,-2.007; J6 0.508,-2.007; J7 0.991,-2.007; J8 1.499,-2.007; J9 2.007,-2.007
PG-TSNP-6-2_INF = smd 0.254 x 0.254: 1 -0.203,0.4; 2 -0.203,0; 3 -0.203,-0.4; 4 0.203,-0.4; 5 0.203,0; 6 0.203,0.4
FIL_B39162B4327P810 = smd 0.3 x 0.375: 1 -0.5,0; 2 0,-0.287; 3 0.5,-0.287; 4 0.5,0.287; 5 0,0.287
DPAK-3_ONS = smd 0.94 x 2.489: 1 -2.29,-6.413; 3 2.29,-6.413 | smd 6.782 x 6.934: 2 0,0
445I23D12M00000_CTS = smd 1.295 x 2.007: 1 -1.852,0; 2 1.852,0
XTAL_ECS-520-8-47-CKM-TR = smd 0.75 x 0.65: 1 -0.525,-0.375; 2 0.525,-0.375; 3 0.525,0.375; 4 -0.525,0.375
XTAL_SC-20S_EPS = smd 0.699 x 1.397: 1 -0.756,0; 2 0.756,0

### Placement (x,y rotation side)
C101  51.44,53.98 0 top
C102  54.48,51.18 0 top
C103  54.48,50.04 0 top
C104  54.48,48.9 0 top
C105  54.48,47.75 0 top
C106  54.48,46.61 0 top
C107  54.48,45.47 0 top
C108  54.48,44.32 0 top
C109  54.48,43.18 0 top
C110  54.48,42.04 0 top
C111  -30.48,142.24 0 top  (outside the outline)
C112  -36.83,142.24 0 top  (outside the outline)
C113  55.88,39.37 0 top
C114  55.88,38.23 0 top
C115  51.44,55.12 0 top
C116  -119.38,137.16 0 top  (outside the outline)
C117  -121.92,-308.61 0 top  (outside the outline)
C118  -121.92,-81.28 0 top  (outside the outline)
C201  -81.28,130.81 0 top  (outside the outline)
C202  -87.63,130.81 0 top  (outside the outline)
C203  -93.98,130.81 0 top  (outside the outline)
C204  -100.33,130.81 0 top  (outside the outline)
C205  -106.68,130.81 0 top  (outside the outline)
C206  -113.03,130.81 0 top  (outside the outline)
C207  -119.38,130.81 0 top  (outside the outline)
C208  -17.78,137.16 0 top  (outside the outline)
C209  -24.13,137.16 0 top  (outside the outline)
C210  -30.48,137.16 0 top  (outside the outline)
C211  -121.92,-200.66 0 top  (outside the outline)
C212  -121.92,-130.81 0 top  (outside the outline)
C213  -121.92,-118.11 0 top  (outside the outline)
C1000  -17.78,142.24 0 top  (outside the outline)
C1001  -24.13,142.24 0 top  (outside the outline)
J101  -105.41,-24.13 0 top  (outside the outline)
J102  -106.68,-279.4 0 top  (outside the outline)
J201  -69.85,58.42 0 top  (outside the outline)
J202  -102.87,-147.32 0 top  (outside the outline)
L201  -121.92,-257.81 0 top  (outside the outline)
L202  -121.92,-264.16 0 top  (outside the outline)
L203  -121.92,-250.19 0 top  (outside the outline)
L204  -119.38,-213.36 0 top  (outside the outline)
L205  -1.07,-232.41 0 top  (outside the outline)
R101  -81.28,137.16 0 top  (outside the outline)
R102  49.91,57.91 90 top
R103  51.18,57.91 90 top
R104  -121.92,-54.61 0 top  (outside the outline)
R105  -121.92,-49.53 0 top  (outside the outline)
R106  -55.88,137.16 0 top  (outside the outline)
R107  -62.23,137.16 0 top  (outside the outline)
R108  -115.57,-308.61 0 top  (outside the outline)
R109  -68.58,137.16 0 top  (outside the outline)
R201  -87.63,137.16 0 top  (outside the outline)
S101  -104.14,106.68 0 top  (outside the outline)
S102  -31.75,58.42 0 top  (outside the outline)
U101  45.72,50.8 0 top
U102  45.21,58.8 0 top
U103  -104.14,-63.5 0 top  (outside the outline)
U201  -60.96,119.38 0 top  (outside the outline)
U202  -106.68,-90.17 0 top  (outside the outline)
U203  -107.95,-176.53 0 top  (outside the outline)
U204  -120.65,-195.58 0 top  (outside the outline)
U1000  -107.95,60.96 0 top  (outside the outline)
X101  -27.94,119.38 0 top  (outside the outline)
X201  -0.53,-13.07 0 top  (outside the outline)
X202  -106.68,-105.41 0 top  (outside the outline)

### Tracks (layer width: path | path; a pad name or v marks a point on that pad's centre or on a via)
+3V3  (21 unrouted)
  Top 0.152: U101.49 U101.48 46.33,52.78 | 46.33,52.78 46.48,52.63 47.5,52.63 | 47.5,52.63 47.68,52.63 47.95,52.91 U101.44 U101.43 U101.42 50.25,53.44 C101.1 | U101.33 47.75,49.78 | 47.75,49.78 47.55,49.99 47.55,52.58 47.5,52.63 | U101.22 45.92,48.79 46.1,48.97 47.41,48.97 47.55,49.1 47.55,49.58 47.75,49.78 | 43.89,52.49 43.89,49.91 43.76,49.78 U101.10 | 43.89,52.49 43.89,53.14 43.59,53.44 U101.1 | 43.89,52.49 44.02,52.63 46.18,52.63 46.33,52.78 | C110.1 C109.1 C108.1 C107.1 C106.1 C105.1 C104.1 C103.1 C102.1
+5V  (3 unrouted)
BT_NRESET_IO  (1 unrouted)
GND  (via drill 0.2, 0.35)  (74 unrouted)
  Top 0.152: U101.57 45.72,50.42 44.7,49.4 U101.19 | 43.18,56.9 45.09,58.8 U102.9 | C102.2 C103.2 C104.2 C105.2 C106.2 C107.2 C108.2 C109.2 C110.2 | C115.2 C101.2 | C113.2 C114.2
  Top 0.508: v43.69,48.77 U101.57 | v45.21,61.47 U102.9
  pour Bottom: 0,80.01 0,0 99.06,0 99.06,80.01
GPS_NRESET  (1 unrouted)
GPS_NRESET_IO  (1 unrouted)
GPS_PIO13  (1 unrouted)
N$1  (1 unrouted)
N$2
  Top 0.152: 46.76,54.18 U101.47 46.74,54.79 47.4,55.45 48.94,55.45 49.91,56.42 R102.1
N$3
  Top 0.152: U101.46 47.14,54.76 47.52,55.14 49.06,55.14 50.3,56.38 R103.1
N$4  (2 unrouted)
N$5  (1 unrouted)
N$6  (1 unrouted)
N$7  (2 unrouted)
N$8  (4 unrouted)
N$9  (1 unrouted)
N$10  (1 unrouted)
N$11  (1 unrouted)
N$12  (3 unrouted)
N$13  (3 unrouted)
N$14  (1 unrouted)
N$15  (2 unrouted)
N$16  (1 unrouted)
N$17  (1 unrouted)
N$19  (1 unrouted)
N$20  (1 unrouted)
N$21  (1 unrouted)
N$22  (1 unrouted)
N$23  (1 unrouted)
N$24  (1 unrouted)
N$25  (1 unrouted)
QSPI_D0
  Top 0.152: U102.5 47.59,56.4 44.46,56.4 44.3,56.24 U101.53
QSPI_D1
  Top 0.152: U102.2 42.34,59.19 41.33,58.17 41.33,56.46 41.69,56.1 43.22,56.1 43.48,55.83 U101.55
QSPI_D2
  Top 0.152: U102.3 42.34,57.92 41.63,57.21 41.63,56.59 41.81,56.4 43.67,56.4 43.89,56.19 U101.54
QSPI_D3
  Top 0.152: U102.7 48.08,59.19 49.1,58.17 49.1,56.46 48.43,55.79 45.25,55.79 45.11,55.65 U101.51
QSPI_SCLK
  Top 0.152: U102.6 48.08,57.92 48.79,57.21 48.79,56.59 48.3,56.1 44.96,56.1 44.7,55.84 U101.52
QSPI_SS  (2 unrouted)
  Top 0.152: U102.1 42.34,60.46 41.02,59.14 41.02,56.33 41.56,55.79 42.89,55.79 43.08,55.6 U101.56
RP_NRESET  (6 unrouted)
SD_DET  (2 unrouted)
SPI0_CS_GPS  (1 unrouted)
SPI0_CS_SD  (1 unrouted)
SPI0_MISO  (2 unrouted)
SPI0_MOSI  (2 unrouted)
SPI0_SCK  (2 unrouted)
SPI1_CS_SX  (1 unrouted)
SPI1_MISO  (1 unrouted)
SPI1_MOSI  (1 unrouted)
SPI1_SCK  (1 unrouted)
SX_BUSY  (1 unrouted)
SX_NRESET  (1 unrouted)
SX_NRESET_IO  (1 unrouted)
U1  (2 unrouted)
USB_D+  (2 unrouted)
USB_D-  (2 unrouted)
VCC  (3 unrouted)
  Top 0.152: C115.1 50.51,54.84 47.73,54.84 47.55,54.66 U101.45 | C113.1 C114.1
XIN  (2 unrouted)
XOUT  (1 unrouted)